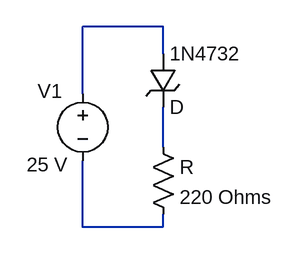
[diagram p0: schematic figure1.asc]
figure1.asc, the LTspice schematic file:
Version 4
SHEET 1 880 680
WIRE 240 64 144 64
WIRE 240 96 240 64
WIRE 144 144 144 64
WIRE 240 208 240 160
WIRE 144 304 144 224
WIRE 240 304 240 288
WIRE 240 304 144 304
SYMBOL voltage 144 128 R0
WINDOW 0 -54 13 Left 2
WINDOW 3 -67 101 Left 2
SYMATTR InstName V1
SYMATTR Value 25 V
SYMBOL res 224 192 R0
SYMATTR InstName R
SYMATTR Value 220 Ohms
SYMBOL zener 224 96 R0
SYMATTR InstName 1N4732

The netlist it stands for:
* figure1.asc
V1 N001 N003 25 V
R N002 N003 220 Ohms
D§1N4732 N001 N002 D
.model D D
.lib standard.dio
.backanno
.end